# EAGLE design Grove-Base Shield v1.3 (EAGLE 6.3)
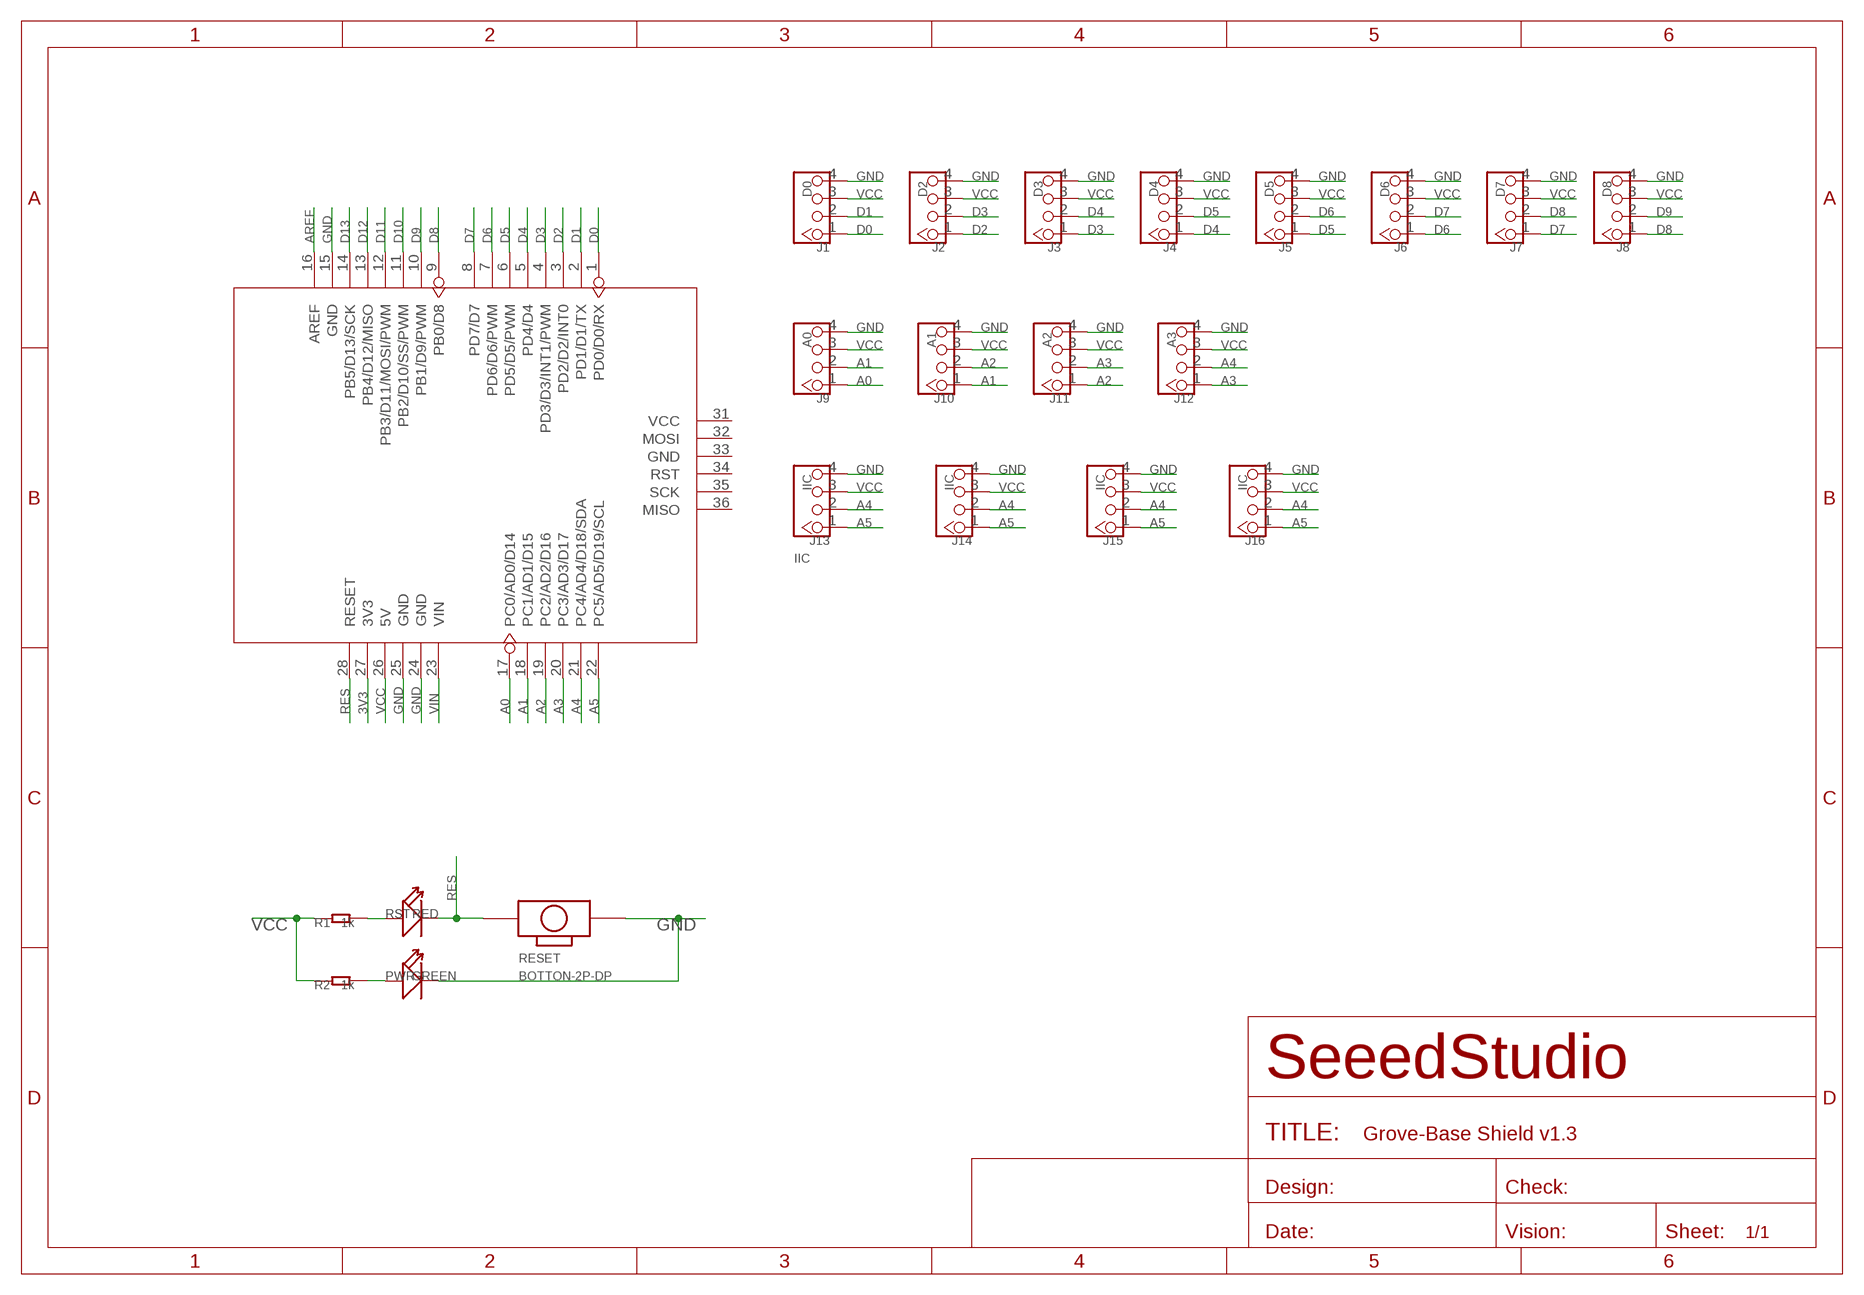
[diagram p0: schematic, sheet 1]

## Parts
J1  D0  TWIG-4P-2.0-2.0  [4P-2.0]
J2  D2  TWIG-4P-2.0-2.0  [4P-2.0]
J3  D3  TWIG-4P-2.0-2.0  [4P-2.0]
J4  D4  TWIG-4P-2.0-2.0  [4P-2.0]
J5  D5  TWIG-4P-2.0-2.0  [4P-2.0]
J6  D6  TWIG-4P-2.0-2.0  [4P-2.0]
J7  D7  TWIG-4P-2.0-2.0  [4P-2.0]
J8  D8  TWIG-4P-2.0-2.0  [4P-2.0]
J9  A0  TWIG-4P-2.0'90D'  [4P-2.0-90D]
J10  A1  TWIG-4P-2.0'90D'  [4P-2.0-90D]
J11  A2  TWIG-4P-2.0'90D'  [4P-2.0-90D]
J12  A3  TWIG-4P-2.0'90D'  [4P-2.0-90D]
J13  IIC  TWIG-4P-2.0-2.0  [4P-2.0]
J14  IIC  TWIG-4P-2.0-2.0  [4P-2.0]
J15  IIC  TWIG-4P-2.0-2.0  [4P-2.0]
J16  IIC  TWIG-4P-2.0-2.0  [4P-2.0]
PWR  GREEN  LED-3MM  [LED-2P-2.54-3MM]
R1  1k  R-0204/7  [R0204/7]
R2  1k  R-0204/7  [R0204/7]
RESET  BOTTON-2P-DP  BOTTON-2P-90  [2P-7.62X3.56-90D]
RST  RED  LED-3MM  [LED-2P-2.54-3MM]
U1  ARDUINO'W/O-SILK'  [ARDUINO-W/O-SILK]

## Nets
3V3: U1.27(3V3)
A0: J9.1 U1.17(PC0/AD0/D14)
A1: J9.2 J10.1 U1.18(PC1/AD1/D15)
A2: J10.2 J11.1 U1.19(PC2/AD2/D16)
A3: J11.2 J12.1 U1.20(PC3/AD3/D17)
A4: J12.2 J13.2 J14.2 J15.2 J16.2 U1.21(PC4/AD4/D18/SDA)
A5: J13.1 J14.1 J15.1 J16.1 U1.22(PC5/AD5/D19/SCL)
AREF: U1.16(AREF)
D0: J1.1 U1.1(PD0/D0/RX)
D1: J1.2 U1.2(PD1/D1/TX)
D2: J2.1 U1.3(PD2/D2/INT0)
D3: J2.2 J3.1 U1.4(PD3/D3/INT1/PWM)
D4: J3.2 J4.1 U1.5(PD4/D4)
D5: J4.2 J5.1 U1.6(PD5/D5/PWM)
D6: J5.2 J6.1 U1.7(PD6/D6/PWM)
D7: J6.2 J7.1 U1.8(PD7/D7)
D8: J7.2 J8.1 U1.9(PB0/D8)
D9: J8.2 U1.10(PB1/D9/PWM)
D10: U1.11(PB2/D10/SS/PWM)
D11: U1.12(PB3/D11/MOSI/PWM)
D12: U1.13(PB4/D12/MISO)
D13: U1.14(PB5/D13/SCK)
GND: J1.4 J2.4 J3.4 J4.4 J5.4 J6.4 J7.4 J8.4 J9.4 J10.4 J11.4 J12.4 J13.4 J14.4 J15.4 J16.4 PWR.K(-) RESET.P$2 U1.15(GND) U1.24(GND) U1.25(GND)
N$7: PWR.A(+) R2.2
N$17: R1.2 RST.A(+)
RES: RESET.P$1 RST.K(-) U1.28(RESET)
VCC: J1.3 J2.3 J3.3 J4.3 J5.3 J6.3 J7.3 J8.3 J9.3 J10.3 J11.3 J12.3 J13.3 J14.3 J15.3 J16.3 R1.1 R2.1 U1.26(5V)
VIN: U1.23(VIN)
Unconnected: U1.31(VCC) U1.32(MOSI) U1.33(GND) U1.34(RST) U1.35(SCK) U1.36(MISO)

## Notes on the sheet
- IIC

## Library data of the parts
J1-J16 = Connector:TWIG-4P-2.0
PWR RST = Discrete:LED*
R1 R2 = Discrete:R*
RESET = Discrete:BOTTON-2P
U1 = moudle:ARDUINO

## Net classes
0 default: width 0.203 mm, drill 0.305 mm, clearance 0.152 mm

## Board
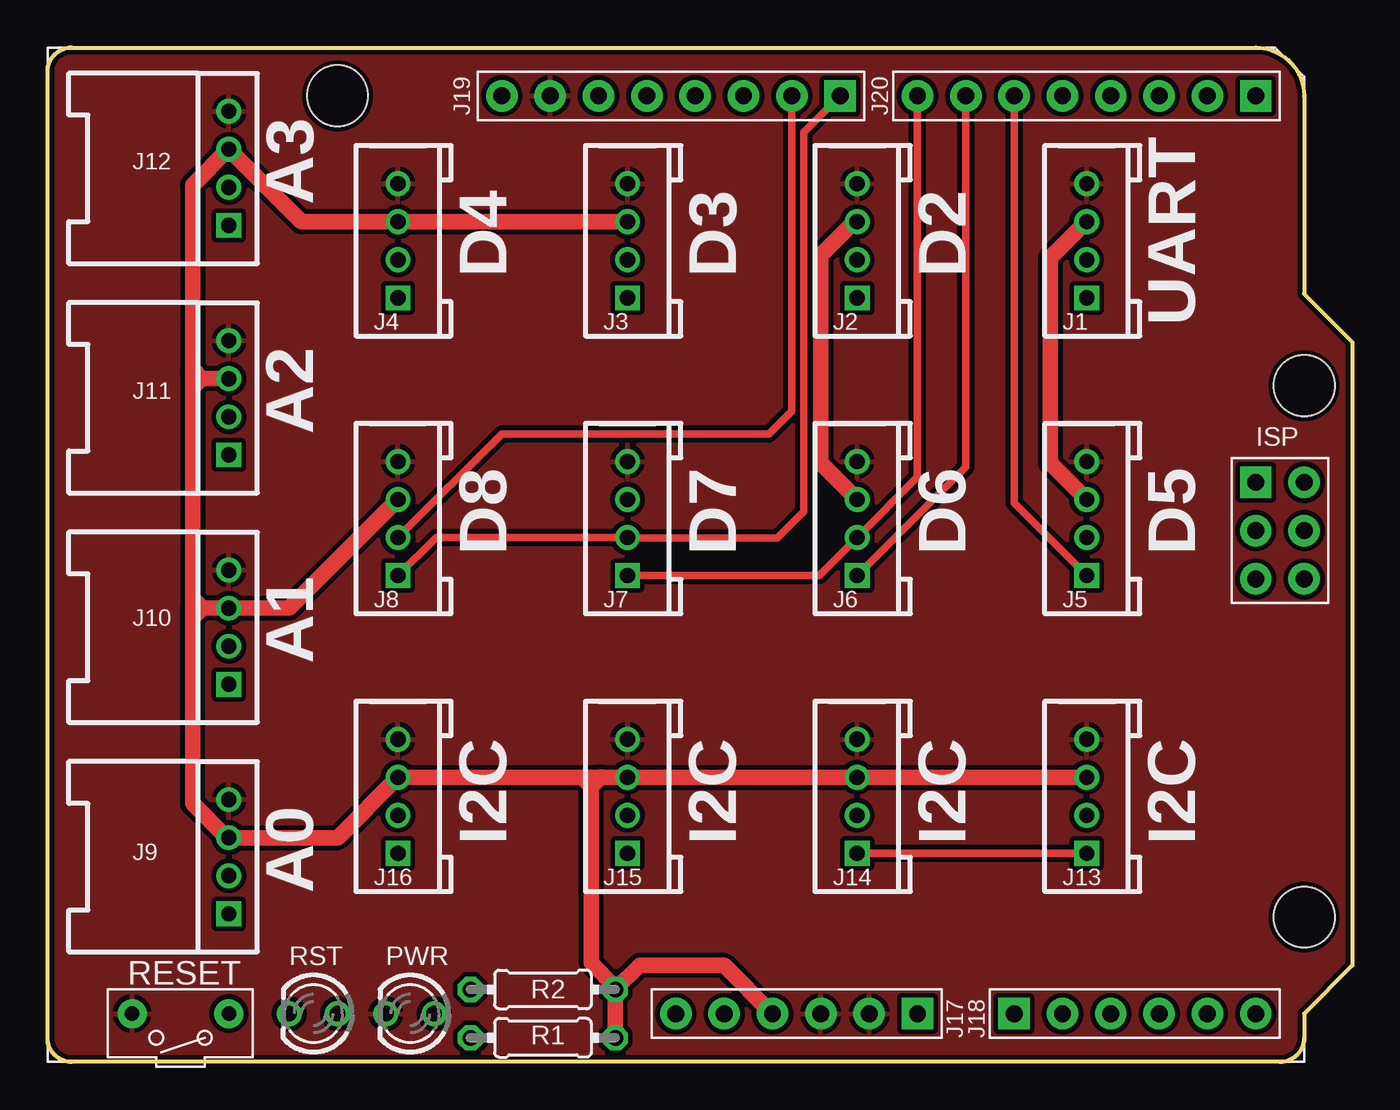
[diagram p1: board, top side]
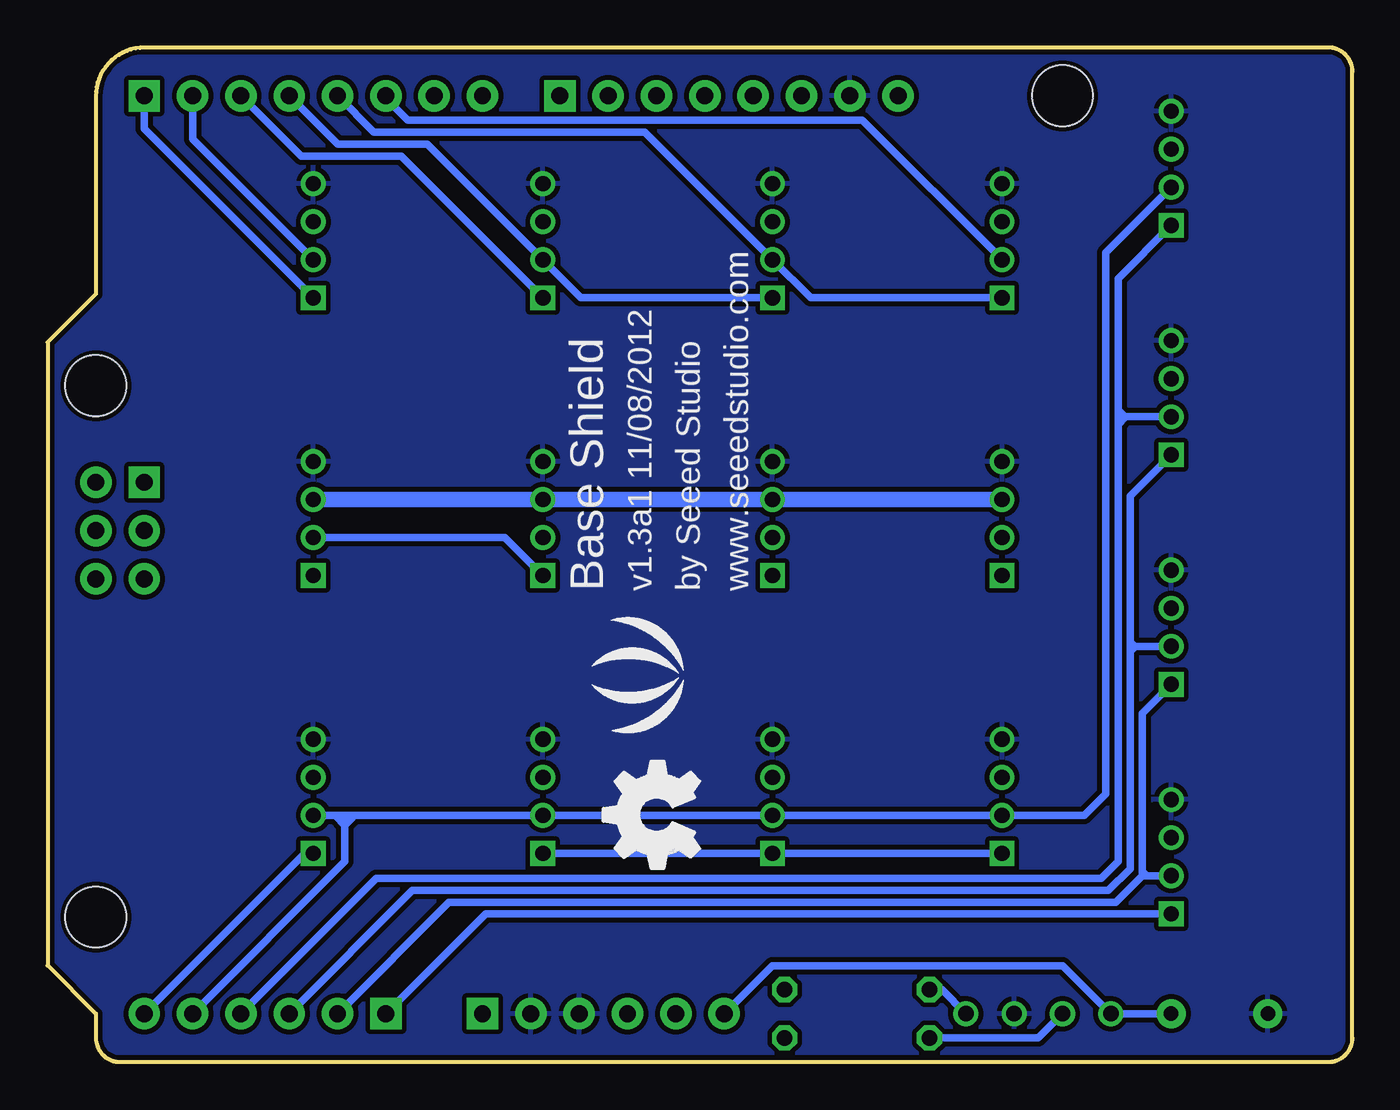
[diagram p2: board, bottom side, seen from below]

Size 68.58 x 53.34 mm. Coordinates in mm from the lower left corner, seen from the top.
Outline: 66.04,2.54 66.04,1.27 arc-90 64.77,0 1.27,0 arc-90 0,1.27 0,52.07 arc-90 1.27,53.34 63.5,53.34 arc-90 66.04,50.8 66.04,40.39 68.58,37.85 68.58,5.08 66.04,2.54
Copper layers (1*16): Top 0.035mm / dielectric 1.5mm / Bottom 0.035mm
Design rules "SeeedStudio_rule_no_angle_090911 *": minimum track width 6mil, minimum drill 12mil, track to track 6mil, track to pad 6mil, pad to pad 6mil, via to via 6mil, smd to smd 0mil, copper to edge 10mil, drill to drill 10mil, minimum pad ring 10mil, minimum via ring 6mil, stop-mask expansion 2mil, vias tented up to drill 100mil, thermal gap 10mil

### Footprints (pad centres in the part's own frame; a part is rotated, then mirrored left to right if it is on the bottom)
4P-2.0 = drill 0.8 pad 1.27 square: 1 -3,0 | drill 0.8 pad 1.27: 2 -1,0; 3 1,0; 4 3,0
4P-2.0-90D = drill 0.8 pad 1.27 square: 1 -3,0 | drill 0.8 pad 1.27: 2 -1,0; 3 1,0; 4 3,0
LED-2P-2.54-3MM = drill 0.813: A -1.27,0; K 1.27,0
R0204/7 = drill 0.813 octagon: 1 -3.81,0; 2 3.81,0
2P-7.62X3.56-90D = drill 0.762 pad 1.524: P$1 0,2.54; P$2 0,-2.54
ARDUINO-W/O-SILK = drill 0.889 pad 1.651 square: 1 63.5,50.8; 9 41.656,50.8; 17 50.8,2.54; 23 45.72,2.54; 36 63.5,30.48 | drill 0.889 pad 1.651: 2 60.96,50.8; 3 58.42,50.8; 4 55.88,50.8; 5 53.34,50.8; 6 50.8,50.8; 7 48.26,50.8; 8 45.72,50.8; 10 39.116,50.8; 11 36.576,50.8; 12 34.036,50.8; 13 31.496,50.8; 14 28.956,50.8; 15 26.416,50.8; 16 23.876,50.8; 18 53.34,2.54; 19 55.88,2.54; 20 58.42,2.54; 21 60.96,2.54; 22 63.5,2.54; 24 43.18,2.54; 25 40.64,2.54; 26 38.1,2.54; 27 35.56,2.54; 28 33.02,2.54; 31 66.04,30.48; 32 66.04,27.94; 33 66.04,25.4; 34 63.5,25.4; 35 63.5,27.94 | hole 3.2: 15.24,50.8; 66.04,35.56; 66.04,7.62

### Placement (x,y rotation side)
J1  54.61,43.18 90 top
J2  42.55,43.18 90 top
J3  30.48,43.18 90 top
J4  18.41,43.18 90 top
J5  54.61,28.57 90 top
J6  42.55,28.57 90 top
J7  30.48,28.57 90 top
J8  18.41,28.57 90 top
J9  9.53,10.79 90 top
J10  9.53,22.86 90 top
J11  9.53,34.92 90 top
J12  9.53,46.99 90 top
J13  54.61,13.97 90 top
J14  42.55,13.97 90 top
J15  30.48,13.97 90 top
J16  18.41,13.97 90 top
PWR  19.05,2.54 180 top
R1  26.04,1.27 180 top
R2  26.04,3.81 180 top
RESET  6.99,2.54 270 top
RST  13.97,2.54 180 top
U1  0,0 0 top
U$2  [OSHW_FILLX200_NOTEXT]  34.29,10.16 90 bottom
U$4  [LOGO_SILK]  36.83,20.32 90 bottom

### Tracks (layer width: path | path; a pad name or v marks a point on that pad's centre or on a via)
A0
  Bottom 0.406: J9.1 45.55,7.79 U1.17
A1
  Bottom 0.406: U1.18 47.5,8.38 12.45,8.38 11.05,9.78 | 11.05,9.78 11.05,10.03 | 11.05,10.03 11.05,18.34 J10.1 | J9.2 10.69,9.79 10.81,9.79 | 10.81,9.79 11.03,9.79 11.05,9.78 | 10.81,9.79 11.05,10.03
A2
  Bottom 0.406: U1.19 49.4,9.02 12.83,9.02 11.68,10.16 11.68,21.59 | 11.68,21.59 11.68,21.97 | 11.68,21.97 11.68,22.1 | 11.68,22.1 11.68,29.77 J11.1 | J10.2 11.35,21.86 11.41,21.86 | 11.45,21.86 11.57,21.86 11.68,21.97 | 11.41,21.86 11.45,21.86 | 11.45,21.86 11.68,22.1 | 11.41,21.86 11.68,21.59
A3
  Bottom 0.406: U1.20 51.31,9.65 13.21,9.65 12.32,10.54 12.32,33.53 | 12.32,33.53 12.32,33.91 | 12.32,33.91 12.32,34.29 | 12.32,34.29 12.32,41.2 J12.1 | J11.2 11.89,33.92 11.92,33.92 | 11.95,33.92 12.3,33.92 12.32,33.91 | 11.92,33.92 11.95,33.92 | 11.95,33.92 12.32,34.29 | 11.92,33.92 12.32,33.53
A4
  Bottom 0.406: U1.21 52.96,10.54 52.96,12.45 | J12.2 12.95,42.56 12.95,14.1 14.08,12.97 J16.2 J15.2 | J13.2 52.96,12.97 | 52.96,12.97 J14.2 J15.2 | 52.96,12.45 arc60 52.58,12.83 52.96,12.45 | 52.96,12.45 52.96,12.97 | J15.2 18.56,12.97 | 52.96,12.45 53.47,12.95
A5
  Top 0.406: J14.1 J13.1
  Bottom 0.406: J16.1 J15.1 J14.1 | J13.1 55.07,10.97 U1.22
D0
  Bottom 0.406: U1.1 63.5,49.07 J1.1
D1
  Bottom 0.406: U1.2 60.96,48.53 J1.2
D2
  Bottom 0.406: U1.3 55.24,47.62 49.99,47.62 J2.1
D3
  Bottom 0.406: J3.1 40.55,40.18 J2.2 48.62,48.26 53.34,48.26 U1.4
D4
  Bottom 0.406: J4.1 28.48,40.18 J3.2 | U1.5 51.44,48.9 37.2,48.9 J3.2 | 30.5,42.16 J3.2
D5
  Top 0.406: U1.6 50.8,29.39 J5.1
  Bottom 0.406: U1.6 50.8,50.67 49.66,49.53 25.77,49.53 J4.2 18.43,42.16
D6
  Top 0.406: U1.7 48.26,31.29 J6.1
  Bottom 0.406: J5.2 44.55,27.57 J6.1
D7
  Top 0.406: U1.8 45.72,30.75 J6.2 40.55,25.57 J7.1
D8
  Top 0.406: U1.9 39.75,48.9 39.75,28.96 38.35,27.56 30.5,27.56 J7.2 20.41,27.57 J8.1
D9
  Top 0.406: U1.10 39.12,34.23 37.91,33.02 23.86,33.02 J8.2
GND
  pour Top (isolate 0.254): 0,0 66.04,0 66.04,2.54 68.58,5.08 68.58,37.85 66.04,40.39 66.04,51.82 64.52,53.34 0,53.34 0,0.13
  pour Bottom (isolate 0.254): 0,0.13 0,0 66.04,0 66.04,2.54 68.58,5.08 68.58,37.85 66.04,40.39 66.04,51.82 64.52,53.34 0,53.34
N$7
  Bottom 0.406: R2.2 21.59,3.81 PWR.A
N$17
  Bottom 0.406: R1.2 16.51,1.27 RST.A
RES
  Bottom 0.406: RESET.P$1 RST.K 15.23,5.07 30.49,5.07 U1.28
VCC
  Top 0.813: 7.62,23.37 7.62,13.59 9.41,11.79 J9.3 15.24,11.79 J16.3 28.83,14.97 | 7.62,23.37 7.62,23.88 | 8.03,23.86 J10.3 12.7,23.86 J8.3 | 8.03,23.86 7.64,23.86 7.62,23.88 | 8.03,23.86 8.03,23.97 7.75,24.26 | 7.62,23.37 8,23.75 | 28.83,14.97 J15.3 J14.3 J13.3 | 7.62,36.45 7.62,46.1 9.51,47.99 J12.3 13.34,44.18 J4.3 J3.3 | 7.62,36.45 7.62,36.2 | 7.62,36.2 7.62,23.88 | J11.3 7.89,35.92 7.62,36.2 | 7.62,36.45 8.13,35.94 7.75,35.56 | R1.1 R2.1 | R2.1 29.84,3.94 28.57,5.21 28.57,14.48 | 28.57,14.48 28.57,14.72 28.83,14.97 | U1.26 35.56,5.08 31.11,5.08 R2.1 | J1.3 54.59,44.18 52.7,42.29 52.7,31.48 J5.3 | J2.3 42.4,44.18 40.64,42.42 40.64,31.48 J6.3 | 28.57,14.48 28.19,14.86 | 28.57,14.48 29.08,14.99
  Bottom 0.813: J8.3 J7.3 J6.3 J5.3

### Text on the board
tPlace: J19 | J20 | A3 | D4 | D3 | D2 | UART | A2 | ISP | D8 | D7 | D6 | D5 | A1 | I2C | I2C | I2C | I2C | A0 | J17 | J18
bPlace: www.seeedstudio.com | by Seeed Studio | v1.3a1 11/08/2012 | Base Shield
bPlate: A0 | A2 | A4 | SPI | UART